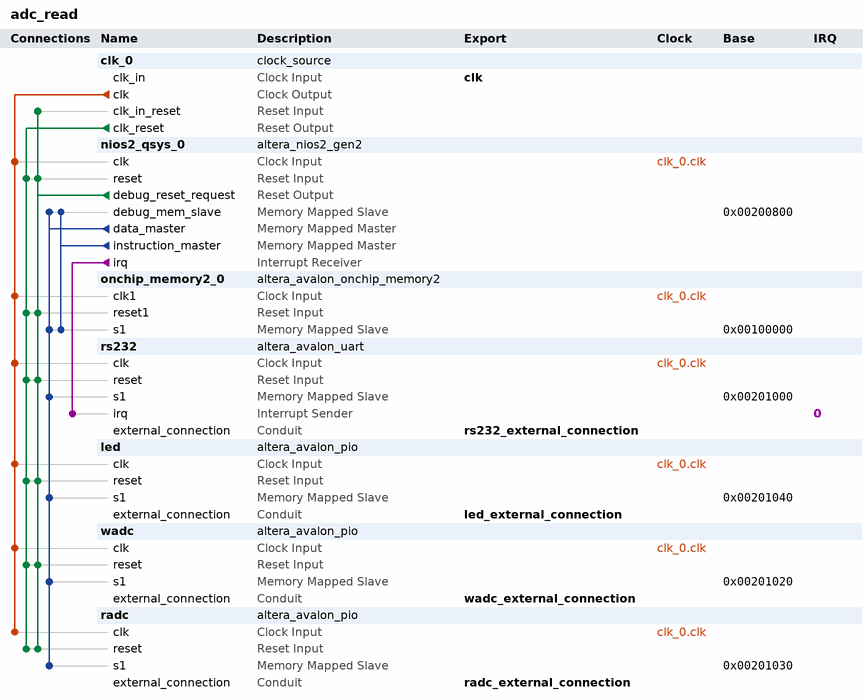
[diagram p0: system contents]
# Platform Designer (Qsys) system adc_read, Cyclone V 5CSEBA6U23I7
# Parameters at their usual value, and those the tool derives, are not listed.
package require -exact qsys 18.1
create_system adc_read
set_project_property DEVICE_FAMILY {Cyclone V}
set_project_property DEVICE 5CSEBA6U23I7

add_instance clk_0 clock_source 18.1
set_instance_parameter_value clk_0 clockFrequency 50000000

add_instance nios2_qsys_0 altera_nios2_gen2 18.1
set_instance_parameter_value nios2_qsys_0 dcache_size 2048
set_instance_parameter_value nios2_qsys_0 exceptionSlave onchip_memory2_0.s1
set_instance_parameter_value nios2_qsys_0 icache_size 4096
set_instance_parameter_value nios2_qsys_0 impl Fast
set_instance_parameter_value nios2_qsys_0 resetSlave onchip_memory2_0.s1
set_instance_parameter_value nios2_qsys_0 setting_activateTrace true

add_instance onchip_memory2_0 altera_avalon_onchip_memory2 18.1
set_instance_parameter_value onchip_memory2_0 dataWidth 32
set_instance_parameter_value onchip_memory2_0 dualPort false
set_instance_parameter_value onchip_memory2_0 initMemContent true
set_instance_parameter_value onchip_memory2_0 initializationFileName onchip_mem.hex
set_instance_parameter_value onchip_memory2_0 memorySize 640000

add_instance rs232 altera_avalon_uart 18.1
set_instance_parameter_value rs232 baud 115200
set_instance_parameter_value rs232 dataBits 8
set_instance_parameter_value rs232 fixedBaud true
set_instance_parameter_value rs232 parity NONE
set_instance_parameter_value rs232 stopBits 1

add_instance led altera_avalon_pio 18.1
set_instance_parameter_value led direction Output
set_instance_parameter_value led width 8

add_instance wadc altera_avalon_pio 18.1
set_instance_parameter_value wadc direction Output
set_instance_parameter_value wadc width 3

add_instance radc altera_avalon_pio 18.1
set_instance_parameter_value radc direction Input
set_instance_parameter_value radc width 12

# connections
add_connection clk_0.clk led.clk clock
add_connection clk_0.clk nios2_qsys_0.clk clock
add_connection clk_0.clk onchip_memory2_0.clk1 clock
add_connection clk_0.clk radc.clk clock
add_connection clk_0.clk rs232.clk clock
add_connection clk_0.clk wadc.clk clock
add_connection clk_0.clk_reset led.reset reset
add_connection clk_0.clk_reset nios2_qsys_0.reset reset
add_connection clk_0.clk_reset onchip_memory2_0.reset1 reset
add_connection clk_0.clk_reset radc.reset reset
add_connection clk_0.clk_reset rs232.reset reset
add_connection clk_0.clk_reset wadc.reset reset
add_connection nios2_qsys_0.debug_reset_request clk_0.clk_in_reset reset
add_connection nios2_qsys_0.debug_reset_request led.reset reset
add_connection nios2_qsys_0.debug_reset_request nios2_qsys_0.reset reset
add_connection nios2_qsys_0.debug_reset_request onchip_memory2_0.reset1 reset
add_connection nios2_qsys_0.debug_reset_request radc.reset reset
add_connection nios2_qsys_0.debug_reset_request rs232.reset reset
add_connection nios2_qsys_0.debug_reset_request wadc.reset reset
add_connection nios2_qsys_0.data_master led.s1 avalon
set_connection_parameter_value nios2_qsys_0.data_master/led.s1 baseAddress 0x00201040
add_connection nios2_qsys_0.data_master nios2_qsys_0.debug_mem_slave avalon
set_connection_parameter_value nios2_qsys_0.data_master/nios2_qsys_0.debug_mem_slave baseAddress 0x00200800
add_connection nios2_qsys_0.data_master onchip_memory2_0.s1 avalon
set_connection_parameter_value nios2_qsys_0.data_master/onchip_memory2_0.s1 baseAddress 0x00100000
add_connection nios2_qsys_0.data_master radc.s1 avalon
set_connection_parameter_value nios2_qsys_0.data_master/radc.s1 baseAddress 0x00201030
add_connection nios2_qsys_0.data_master rs232.s1 avalon
set_connection_parameter_value nios2_qsys_0.data_master/rs232.s1 baseAddress 0x00201000
add_connection nios2_qsys_0.data_master wadc.s1 avalon
set_connection_parameter_value nios2_qsys_0.data_master/wadc.s1 baseAddress 0x00201020
add_connection nios2_qsys_0.instruction_master nios2_qsys_0.debug_mem_slave avalon
set_connection_parameter_value nios2_qsys_0.instruction_master/nios2_qsys_0.debug_mem_slave baseAddress 0x00200800
add_connection nios2_qsys_0.instruction_master onchip_memory2_0.s1 avalon
set_connection_parameter_value nios2_qsys_0.instruction_master/onchip_memory2_0.s1 baseAddress 0x00100000
add_connection nios2_qsys_0.irq rs232.irq interrupt
set_connection_parameter_value nios2_qsys_0.irq/rs232.irq irqNumber 0

# exported interfaces
add_interface clk clock sink
set_interface_property clk EXPORT_OF clk_0.clk_in
add_interface led_external_connection conduit end
set_interface_property led_external_connection EXPORT_OF led.external_connection
add_interface radc_external_connection conduit end
set_interface_property radc_external_connection EXPORT_OF radc.external_connection
add_interface rs232_external_connection conduit end
set_interface_property rs232_external_connection EXPORT_OF rs232.external_connection
add_interface wadc_external_connection conduit end
set_interface_property wadc_external_connection EXPORT_OF wadc.external_connection

set_interconnect_requirement {$system} qsys_mm.clockCrossingAdapter HANDSHAKE
set_interconnect_requirement {$system} qsys_mm.maxAdditionalLatency 1

save_system adc_read.qsys
